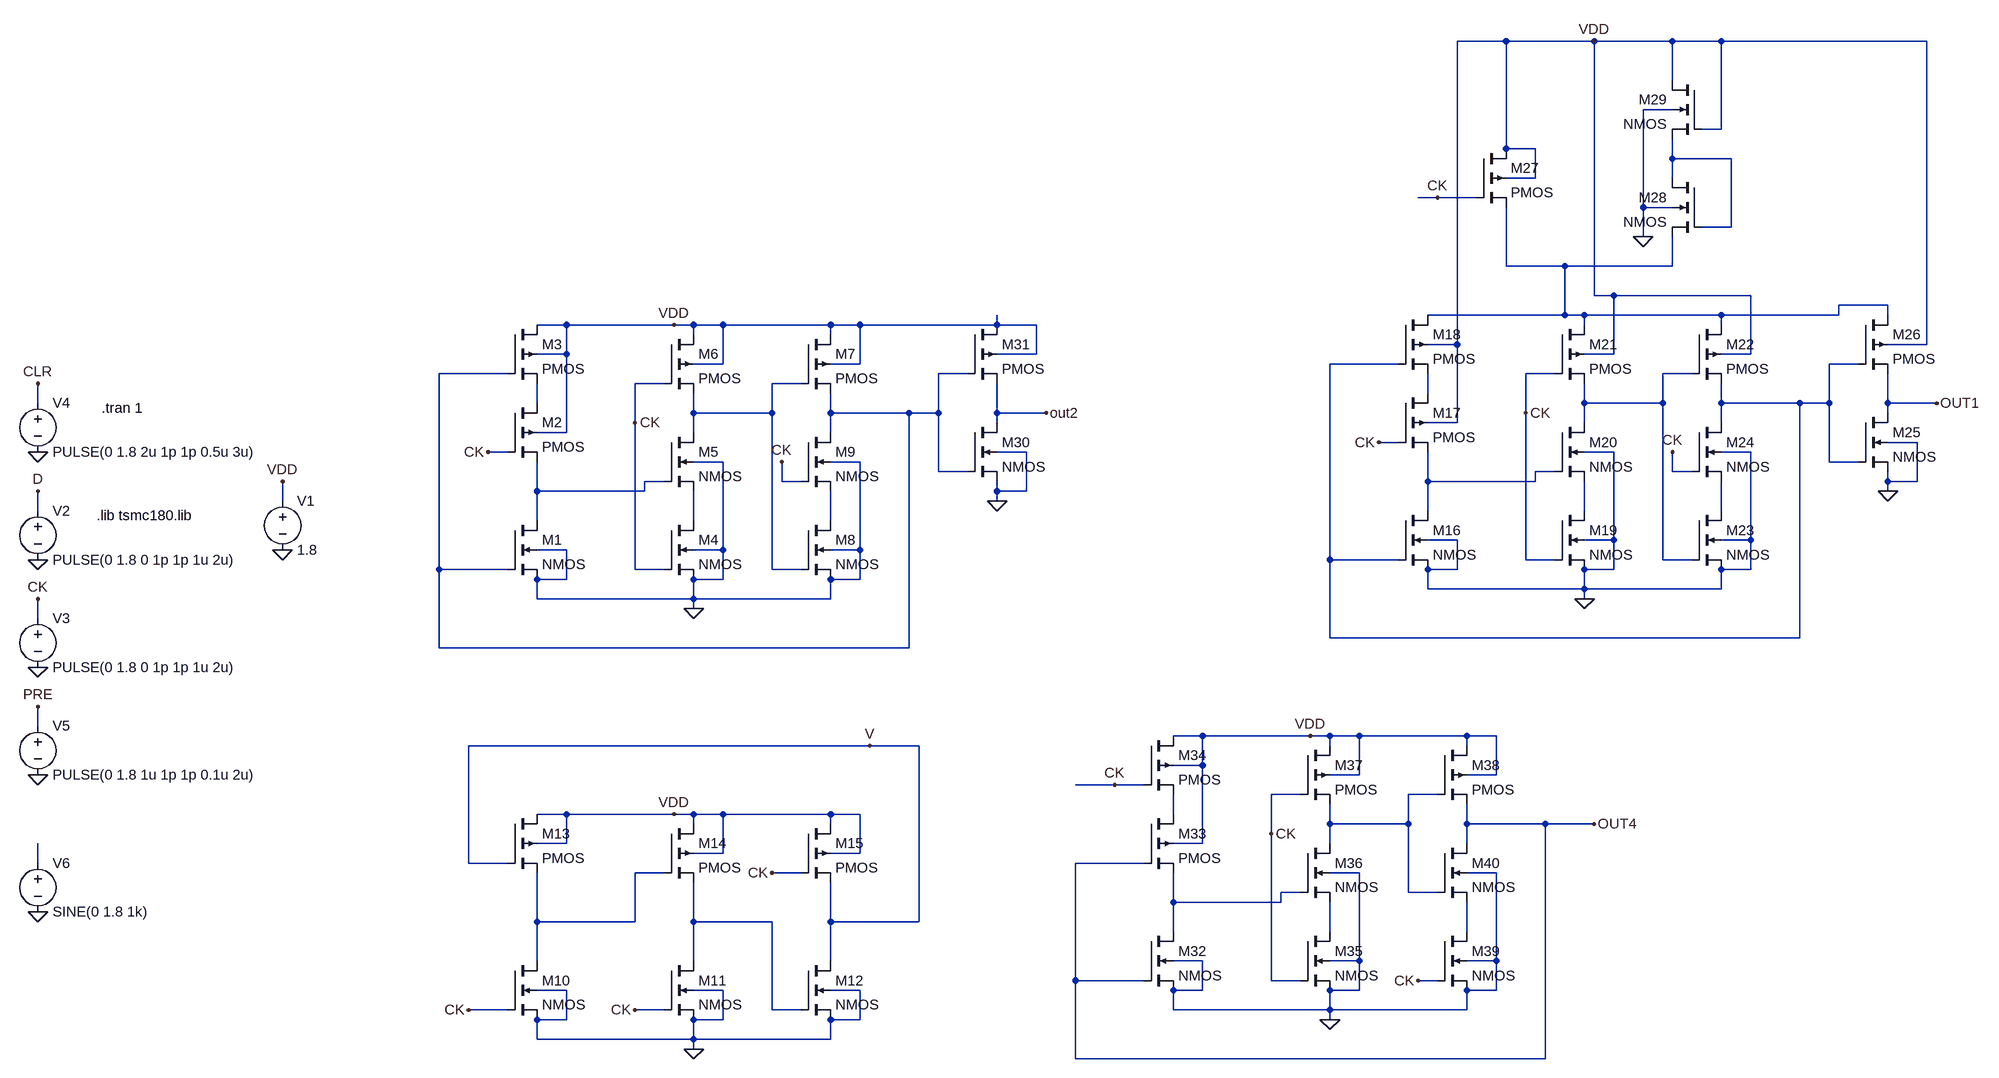
[diagram p0: schematic divider.asc]
divider.asc, the LTspice schematic file:
Version 4
SHEET 1 2704 868
WIRE 1920 -800 1840 -800
WIRE 2064 -800 1920 -800
WIRE 2192 -800 2064 -800
WIRE 2272 -800 2192 -800
WIRE 2608 -800 2272 -800
WIRE 2192 -736 2192 -800
WIRE 2192 -688 2144 -688
WIRE 2272 -656 2272 -800
WIRE 2272 -656 2240 -656
WIRE 1920 -624 1920 -800
WIRE 1968 -624 1920 -624
WIRE 2192 -608 2192 -640
WIRE 2288 -608 2192 -608
WIRE 1968 -576 1968 -624
WIRE 1968 -576 1920 -576
WIRE 2192 -576 2192 -608
WIRE 1808 -544 1776 -544
WIRE 1872 -544 1808 -544
WIRE 2144 -528 2144 -688
WIRE 2192 -528 2144 -528
WIRE 2288 -496 2288 -608
WIRE 2288 -496 2240 -496
WIRE 2144 -480 2144 -528
WIRE 1920 -432 1920 -528
WIRE 2016 -432 1920 -432
WIRE 2192 -432 2192 -480
WIRE 2192 -432 2016 -432
WIRE 2064 -384 2064 -800
WIRE 2096 -384 2064 -384
WIRE 2320 -384 2096 -384
WIRE 2544 -368 2464 -368
WIRE 2016 -352 2016 -432
WIRE 2016 -352 1792 -352
WIRE 2048 -352 2016 -352
WIRE 2272 -352 2048 -352
WIRE 2464 -352 2464 -368
WIRE 2464 -352 2272 -352
WIRE 2544 -352 2544 -368
WIRE 384 -336 336 -336
WIRE 560 -336 384 -336
WIRE 592 -336 560 -336
WIRE 640 -336 592 -336
WIRE 816 -336 640 -336
WIRE 864 -336 816 -336
WIRE 1088 -336 1088 -352
WIRE 1088 -336 864 -336
WIRE 1152 -336 1088 -336
WIRE 2048 -336 2048 -352
WIRE 2272 -336 2272 -352
WIRE 592 -320 592 -336
WIRE 816 -320 816 -336
WIRE 1840 -304 1840 -800
WIRE 1840 -304 1792 -304
WIRE 2608 -304 2608 -800
WIRE 2608 -304 2544 -304
WIRE 384 -288 384 -336
WIRE 384 -288 336 -288
WIRE 1152 -288 1152 -336
WIRE 1152 -288 1088 -288
WIRE 2096 -288 2096 -384
WIRE 2096 -288 2048 -288
WIRE 2320 -288 2320 -384
WIRE 2320 -288 2272 -288
WIRE 640 -272 640 -336
WIRE 640 -272 592 -272
WIRE 864 -272 864 -336
WIRE 864 -272 816 -272
WIRE 1744 -272 1632 -272
WIRE 2496 -272 2448 -272
WIRE 288 -256 176 -256
WIRE 1040 -256 992 -256
WIRE 2000 -256 1952 -256
WIRE 2224 -256 2176 -256
WIRE 544 -240 496 -240
WIRE 768 -240 720 -240
WIRE 1792 -224 1792 -256
WIRE -480 -208 -480 -240
WIRE 336 -208 336 -240
WIRE 2048 -208 2048 -240
WIRE 2176 -208 2176 -256
WIRE 2176 -208 2048 -208
WIRE 2272 -208 2272 -240
WIRE 2400 -208 2272 -208
WIRE 2448 -208 2448 -272
WIRE 2448 -208 2400 -208
WIRE 2544 -208 2544 -256
WIRE 2624 -208 2544 -208
WIRE 592 -192 592 -224
WIRE 720 -192 720 -240
WIRE 720 -192 592 -192
WIRE 816 -192 816 -224
WIRE 944 -192 816 -192
WIRE 992 -192 992 -256
WIRE 992 -192 944 -192
WIRE 1088 -192 1088 -240
WIRE 1168 -192 1088 -192
WIRE 1952 -192 1952 -256
WIRE 2544 -192 2544 -208
WIRE 496 -176 496 -240
WIRE 1088 -176 1088 -192
WIRE 1840 -176 1840 -304
WIRE 1840 -176 1792 -176
WIRE 2048 -176 2048 -208
WIRE 2272 -176 2272 -208
WIRE 384 -160 384 -288
WIRE 384 -160 336 -160
WIRE 592 -160 592 -192
WIRE 816 -160 816 -192
WIRE 1744 -144 1712 -144
WIRE 2592 -144 2544 -144
WIRE 288 -128 256 -128
WIRE 1136 -128 1088 -128
WIRE 2096 -128 2048 -128
WIRE 2320 -128 2272 -128
WIRE 640 -112 592 -112
WIRE 864 -112 816 -112
WIRE 2448 -112 2448 -208
WIRE 2496 -112 2448 -112
WIRE 992 -96 992 -192
WIRE 1040 -96 992 -96
WIRE 2000 -96 1968 -96
WIRE 2192 -96 2192 -128
WIRE 2224 -96 2192 -96
WIRE 544 -80 512 -80
WIRE 736 -80 736 -112
WIRE 768 -80 736 -80
WIRE 1792 -80 1792 -128
WIRE 1968 -80 1968 -96
WIRE 1968 -80 1792 -80
WIRE 2544 -80 2544 -96
WIRE 2592 -80 2592 -144
WIRE 2592 -80 2544 -80
WIRE 336 -64 336 -112
WIRE 512 -64 512 -80
WIRE 512 -64 336 -64
WIRE 1088 -64 1088 -80
WIRE 1136 -64 1136 -128
WIRE 1136 -64 1088 -64
WIRE 2544 -64 2544 -80
WIRE -80 -48 -80 -80
WIRE 1088 -48 1088 -64
WIRE -480 -32 -480 -64
WIRE 1792 -32 1792 -80
WIRE 2048 -32 2048 -80
WIRE 2272 -32 2272 -80
WIRE 336 -16 336 -64
WIRE 592 -16 592 -64
WIRE 816 -16 816 -64
WIRE 1840 16 1792 16
WIRE 2096 16 2096 -128
WIRE 2096 16 2048 16
WIRE 2320 16 2320 -128
WIRE 2320 16 2272 16
WIRE 384 32 336 32
WIRE 640 32 640 -112
WIRE 640 32 592 32
WIRE 864 32 864 -112
WIRE 864 32 816 32
WIRE 1632 48 1632 -272
WIRE 1744 48 1632 48
WIRE 1952 48 1952 -192
WIRE 2000 48 1952 48
WIRE 2176 48 2176 -208
WIRE 2224 48 2176 48
WIRE 176 64 176 -256
WIRE 288 64 176 64
WIRE 496 64 496 -176
WIRE 544 64 496 64
WIRE 720 64 720 -192
WIRE 768 64 720 64
WIRE 1840 64 1840 16
WIRE 1840 64 1792 64
WIRE 2096 64 2096 16
WIRE 2096 64 2048 64
WIRE 2320 64 2320 16
WIRE 2320 64 2272 64
WIRE 384 80 384 32
WIRE 384 80 336 80
WIRE 640 80 640 32
WIRE 640 80 592 80
WIRE 864 80 864 32
WIRE 864 80 816 80
WIRE 1792 96 1792 64
WIRE 2048 96 2048 64
WIRE 2048 96 1792 96
WIRE 2272 96 2272 64
WIRE 2272 96 2048 96
WIRE 336 112 336 80
WIRE 592 112 592 80
WIRE 592 112 336 112
WIRE 816 112 816 80
WIRE 816 112 592 112
WIRE 2048 112 2048 96
WIRE 592 128 592 112
WIRE -480 144 -480 112
WIRE 1632 176 1632 48
WIRE 2400 176 2400 -208
WIRE 2400 176 1632 176
WIRE 176 192 176 64
WIRE 944 192 944 -192
WIRE 944 192 176 192
WIRE -480 320 -480 288
WIRE 1424 336 1376 336
WIRE 1600 336 1424 336
WIRE 1632 336 1600 336
WIRE 1680 336 1632 336
WIRE 1856 336 1680 336
WIRE 1904 336 1856 336
WIRE 880 352 224 352
WIRE 960 352 880 352
WIRE 1632 352 1632 336
WIRE 1856 352 1856 336
WIRE 1424 384 1424 336
WIRE 1424 384 1376 384
WIRE 1680 400 1680 336
WIRE 1680 400 1632 400
WIRE 1904 400 1904 336
WIRE 1904 400 1856 400
WIRE 1280 416 1216 416
WIRE 1328 416 1280 416
WIRE 1584 432 1536 432
WIRE 1808 432 1760 432
WIRE 384 464 336 464
WIRE 560 464 384 464
WIRE 592 464 560 464
WIRE 640 464 592 464
WIRE 816 464 640 464
WIRE 864 464 816 464
WIRE 1376 464 1376 432
WIRE 592 480 592 464
WIRE 816 480 816 464
WIRE 1632 480 1632 448
WIRE 1760 480 1760 432
WIRE 1760 480 1632 480
WIRE 1856 480 1856 448
WIRE 1984 480 1856 480
WIRE 2064 480 1984 480
WIRE 1536 496 1536 432
WIRE 384 512 384 464
WIRE 384 512 336 512
WIRE 1424 512 1424 384
WIRE 1424 512 1376 512
WIRE 1632 512 1632 480
WIRE 1856 512 1856 480
WIRE 640 528 640 464
WIRE 640 528 592 528
WIRE 864 528 864 464
WIRE 864 528 816 528
WIRE -480 544 -480 512
WIRE 224 544 224 352
WIRE 288 544 224 544
WIRE 1328 544 1216 544
WIRE 544 560 496 560
WIRE 768 560 720 560
WIRE 1680 560 1632 560
WIRE 1904 560 1856 560
WIRE 1584 592 1552 592
WIRE 1760 592 1760 480
WIRE 1808 592 1760 592
WIRE 1376 608 1376 560
WIRE 1552 608 1552 592
WIRE 1552 608 1376 608
WIRE 336 640 336 560
WIRE 496 640 496 560
WIRE 496 640 336 640
WIRE 592 640 592 576
WIRE 720 640 592 640
WIRE 816 640 816 576
WIRE 960 640 960 352
WIRE 960 640 816 640
WIRE 1376 656 1376 608
WIRE 1632 656 1632 608
WIRE 1856 656 1856 608
WIRE 336 704 336 640
WIRE 592 704 592 640
WIRE 816 704 816 640
WIRE 1424 704 1376 704
WIRE 1680 704 1680 560
WIRE 1680 704 1632 704
WIRE 1904 704 1904 560
WIRE 1904 704 1856 704
WIRE 1216 736 1216 544
WIRE 1328 736 1216 736
WIRE 1536 736 1536 496
WIRE 1584 736 1536 736
WIRE 1808 736 1776 736
WIRE 384 752 336 752
WIRE 640 752 592 752
WIRE 864 752 816 752
WIRE 1424 752 1424 704
WIRE 1424 752 1376 752
WIRE 1680 752 1680 704
WIRE 1680 752 1632 752
WIRE 1904 752 1904 704
WIRE 1904 752 1856 752
WIRE 288 784 224 784
WIRE 544 784 496 784
WIRE 720 784 720 640
WIRE 768 784 720 784
WIRE 1376 784 1376 752
WIRE 1632 784 1632 752
WIRE 1632 784 1376 784
WIRE 1856 784 1856 752
WIRE 1856 784 1632 784
WIRE 384 800 384 752
WIRE 384 800 336 800
WIRE 640 800 640 752
WIRE 640 800 592 800
WIRE 864 800 864 752
WIRE 864 800 816 800
WIRE 1632 800 1632 784
WIRE 336 832 336 800
WIRE 592 832 592 800
WIRE 592 832 336 832
WIRE 816 832 816 800
WIRE 816 832 592 832
WIRE 592 848 592 832
WIRE 1216 864 1216 736
WIRE 1984 864 1984 480
WIRE 1984 864 1216 864
FLAG -80 32 0
FLAG -80 -80 VDD
FLAG -480 48 0
FLAG -480 224 0
FLAG -480 -64 D
FLAG -480 -128 0
FLAG -480 -240 CLR
FLAG -480 400 0
FLAG -480 288 PRE
FLAG 592 128 0
FLAG 560 -336 VDD
FLAG 256 -128 CK
FLAG 496 -176 CK
FLAG 736 -112 CK
FLAG 592 848 0
FLAG 560 464 VDD
FLAG 224 784 CK
FLAG 496 784 CK
FLAG 720 560 CK
FLAG 880 352 V
FLAG 2048 112 0
FLAG 1712 -144 CK
FLAG 1952 -192 CK
FLAG 2192 -128 CK
FLAG 2544 -64 0
FLAG 2624 -208 OUT1
FLAG 1808 -544 CK
FLAG 2064 -800 VDD
FLAG 2144 -480 0
FLAG 1088 -48 0
FLAG 1168 -192 out2
FLAG 1632 800 0
FLAG 1600 336 VDD
FLAG 1536 496 CK
FLAG 1280 416 CK
FLAG 1776 736 CK
FLAG 2064 480 OUT4
FLAG -480 624 0
FLAG -480 112 CK
SYMBOL voltage -80 -64 R0
WINDOW 123 0 0 Left 0
WINDOW 39 0 0 Left 0
SYMATTR InstName V1
SYMATTR Value 1.8
SYMBOL voltage -480 -48 R0
WINDOW 123 0 0 Left 0
WINDOW 39 0 0 Left 0
SYMATTR InstName V2
SYMATTR Value PULSE(0 1.8 0 1p 1p 1u 2u)
SYMBOL voltage -480 128 R0
WINDOW 123 0 0 Left 0
WINDOW 39 0 0 Left 0
SYMATTR InstName V3
SYMATTR Value PULSE(0 1.8 0 1p 1p 1u 2u)
SYMBOL voltage -480 -224 R0
WINDOW 123 0 0 Left 0
WINDOW 39 0 0 Left 0
SYMATTR InstName V4
SYMATTR Value PULSE(0 1.8 2u 1p 1p 0.5u 3u)
SYMBOL voltage -480 304 R0
WINDOW 123 0 0 Left 0
WINDOW 39 0 0 Left 0
SYMATTR InstName V5
SYMATTR Value PULSE(0 1.8 1u 1p 1p 0.1u 2u)
SYMBOL nmos4 288 -16 R0
SYMATTR InstName M1
SYMATTR Value2 l=180n w=2u
SYMBOL pmos4 288 -208 R0
SYMATTR InstName M2
SYMATTR Value2 l=180n w=2u
SYMBOL pmos4 288 -336 R0
SYMATTR InstName M3
SYMATTR Value2 l=180n w=2u
SYMBOL nmos4 544 -16 R0
SYMATTR InstName M4
SYMATTR Value2 l=180n w=2u
SYMBOL nmos4 544 -160 R0
SYMATTR InstName M5
SYMATTR Value2 l=180n w=2u
SYMBOL pmos4 544 -320 R0
SYMATTR InstName M6
SYMATTR Value2 l=180n w=2u
SYMBOL pmos4 768 -320 R0
SYMATTR InstName M7
SYMATTR Value2 l=180n w=2u
SYMBOL nmos4 768 -16 R0
SYMATTR InstName M8
SYMATTR Value2 l=180n w=2u
SYMBOL nmos4 768 -160 R0
SYMATTR InstName M9
SYMATTR Value2 l=180n w=2u
SYMBOL nmos4 288 704 R0
SYMATTR InstName M10
SYMATTR Value2 l=180n w=0.3u
SYMBOL nmos4 544 704 R0
SYMATTR InstName M11
SYMATTR Value2 l=180n w=0.6u
SYMBOL nmos4 768 704 R0
SYMATTR InstName M12
SYMATTR Value2 l=180n w=0.6u
SYMBOL pmos4 288 464 R0
SYMATTR InstName M13
SYMATTR Value2 l=180n w=0.6u
SYMBOL pmos4 544 480 R0
SYMATTR InstName M14
SYMATTR Value2 l=180n w=0.3u
SYMBOL pmos4 768 480 R0
SYMATTR InstName M15
SYMATTR Value2 l=180n w=0.4u
SYMBOL nmos4 1744 -32 R0
SYMATTR InstName M16
SYMATTR Value2 l=180n w=2u
SYMBOL pmos4 1744 -224 R0
SYMATTR InstName M17
SYMATTR Value2 l=180n w=2u
SYMBOL pmos4 1744 -352 R0
SYMATTR InstName M18
SYMATTR Value2 l=180n w=2u
SYMBOL nmos4 2000 -32 R0
SYMATTR InstName M19
SYMATTR Value2 l=180n w=2u
SYMBOL nmos4 2000 -176 R0
SYMATTR InstName M20
SYMATTR Value2 l=180n w=2u
SYMBOL pmos4 2000 -336 R0
SYMATTR InstName M21
SYMATTR Value2 l=180n w=2u
SYMBOL pmos4 2224 -336 R0
SYMATTR InstName M22
SYMATTR Value2 l=180n w=2u
SYMBOL nmos4 2224 -32 R0
SYMATTR InstName M23
SYMATTR Value2 l=180n w=2u
SYMBOL nmos4 2224 -176 R0
SYMATTR InstName M24
SYMATTR Value2 l=180n w=2u
SYMBOL nmos4 2496 -192 R0
SYMATTR InstName M25
SYMATTR Value2 l=180n w=2u
SYMBOL pmos4 2496 -352 R0
SYMATTR InstName M26
SYMATTR Value2 l=180n w=2u
SYMBOL pmos4 1872 -624 R0
SYMATTR InstName M27
SYMATTR Value2 l=180n w=2u
SYMBOL nmos4 2240 -576 M0
SYMATTR InstName M28
SYMATTR Value2 l=180n w=2u
SYMBOL nmos4 2240 -736 M0
SYMATTR InstName M29
SYMATTR Value2 l=180n w=2u
SYMBOL nmos4 1040 -176 R0
SYMATTR InstName M30
SYMATTR Value2 l=180n w=2u
SYMBOL pmos4 1040 -336 R0
SYMATTR InstName M31
SYMATTR Value2 l=180n w=2u
SYMBOL nmos4 1328 656 R0
SYMATTR InstName M32
SYMATTR Value2 l=300n w=525n
SYMBOL pmos4 1328 464 R0
SYMATTR InstName M33
SYMATTR Value2 l=300n w=1575n
SYMBOL pmos4 1328 336 R0
SYMATTR InstName M34
SYMATTR Value2 l=300n w=2025n
SYMBOL nmos4 1584 656 R0
SYMATTR InstName M35
SYMATTR Value2 l=300n w=2025n
SYMBOL nmos4 1584 512 R0
SYMATTR InstName M36
SYMATTR Value2 l=300n w=1425n
SYMBOL pmos4 1584 352 R0
SYMATTR InstName M37
SYMATTR Value2 l=300n w=2.4u
SYMBOL pmos4 1808 352 R0
SYMATTR InstName M38
SYMATTR Value2 l=300n w=3u
SYMBOL nmos4 1808 656 R0
SYMATTR InstName M39
SYMATTR Value2 l=300n w=2.1u
SYMBOL nmos4 1808 512 R0
SYMATTR InstName M40
SYMATTR Value2 l=300n w=1725n
SYMBOL voltage -480 528 R0
WINDOW 123 0 0 Left 0
WINDOW 39 0 0 Left 0
SYMATTR InstName V6
SYMATTR Value SINE(0 1.8 1k)
TEXT -376 -200 Left 2 !.tran 1
TEXT -384 -24 Left 2 !.lib tsmc180.lib

The netlist it stands for:
* divider.asc
V1 VDD 0 1.8
V2 D 0 PULSE(0 1.8 0 1p 1p 1u 2u)
V3 CK 0 PULSE(0 1.8 0 1p 1p 1u 2u)
V4 CLR 0 PULSE(0 1.8 2u 1p 1p 0.5u 3u)
V5 PRE 0 PULSE(0 1.8 1u 1p 1p 0.1u 2u)
M1 N010 N004 0 0 NMOS l=180n w=2u
M2 N008 CK N010 VDD PMOS l=180n w=2u
M3 VDD N004 N008 VDD PMOS l=180n w=2u
M4 N013 CK 0 0 NMOS l=180n w=2u
M5 N006 N010 N013 0 NMOS l=180n w=2u
M6 VDD CK N006 VDD PMOS l=180n w=2u
M7 VDD N006 N004 VDD PMOS l=180n w=2u
M8 N014 N006 0 0 NMOS l=180n w=2u
M9 N004 CK N014 0 NMOS l=180n w=2u
M10 N018 CK 0 0 NMOS l=180n w=0.3u
M11 N020 CK 0 0 NMOS l=180n w=0.6u
M12 V N020 0 0 NMOS l=180n w=0.6u
M13 VDD V N018 VDD PMOS l=180n w=0.6u
M14 VDD N018 N020 VDD PMOS l=180n w=0.3u
M15 VDD CK V VDD PMOS l=180n w=0.4u
M16 N009 N003 0 0 NMOS l=180n w=2u
M17 N007 CK N009 VDD PMOS l=180n w=2u
M18 N002 N003 N007 VDD PMOS l=180n w=2u
M19 N011 CK 0 0 NMOS l=180n w=2u
M20 N005 N009 N011 0 NMOS l=180n w=2u
M21 N002 CK N005 VDD PMOS l=180n w=2u
M22 N002 N005 N003 VDD PMOS l=180n w=2u
M23 N012 N005 0 0 NMOS l=180n w=2u
M24 N003 CK N012 0 NMOS l=180n w=2u
M25 OUT1 N003 0 0 NMOS l=180n w=2u
M26 N002 N003 OUT1 VDD PMOS l=180n w=2u
M27 VDD CK N002 VDD PMOS l=180n w=2u
M28 N001 N001 N002 0 NMOS l=180n w=2u
M29 VDD VDD N001 0 NMOS l=180n w=2u
M30 out2 N004 0 0 NMOS l=180n w=2u
M31 VDD N004 out2 VDD PMOS l=180n w=2u
M32 N019 OUT4 0 0 NMOS l=300n w=525n
M33 N016 OUT4 N019 VDD PMOS l=300n w=1575n
M34 VDD CK N016 VDD PMOS l=300n w=2025n
M35 N021 CK 0 0 NMOS l=300n w=2025n
M36 N015 N019 N021 0 NMOS l=300n w=1425n
M37 VDD CK N015 VDD PMOS l=300n w=2.4u
M38 VDD N015 OUT4 VDD PMOS l=300n w=3u
M39 N022 CK 0 0 NMOS l=300n w=2.1u
M40 OUT4 N015 N022 0 NMOS l=300n w=1725n
V6 N017 0 SINE(0 1.8 1k)
.model NMOS NMOS
.model PMOS PMOS
.lib standard.mos
.tran 1
.lib tsmc180.lib
.backanno
.end